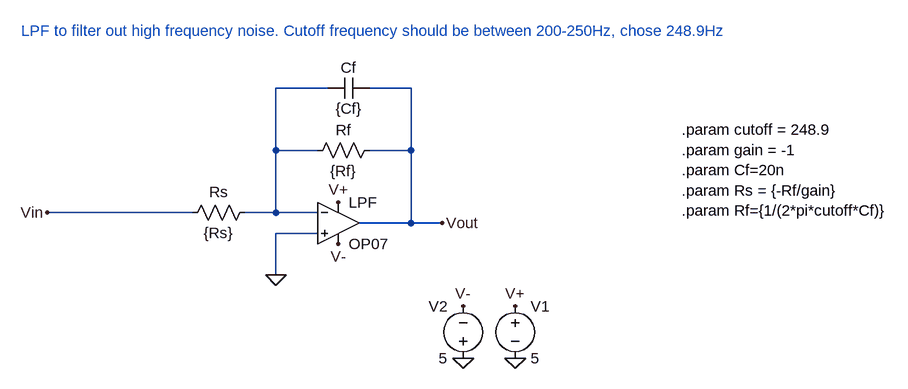
[diagram p0: schematic LPF.asc]
LPF.asc, the LTspice schematic file:
Version 4
SHEET 1 1440 680
WIRE 496 112 416 112
WIRE 624 112 560 112
WIRE 416 208 416 112
WIRE 480 208 416 208
WIRE 624 208 624 112
WIRE 624 208 560 208
WIRE 288 304 64 304
WIRE 416 304 416 208
WIRE 416 304 368 304
WIRE 480 304 416 304
WIRE 624 320 624 208
WIRE 624 320 544 320
WIRE 672 320 624 320
WIRE 480 336 416 336
WIRE 416 400 416 336
FLAG 704 528 0
FLAG 784 528 0
FLAG 416 400 0
FLAG 512 352 V-
FLAG 704 448 V-
FLAG 512 288 V+
FLAG 784 448 V+
FLAG 64 304 Vin
FLAG 672 320 Vout
SYMBOL voltage 784 432 R0
WINDOW 123 0 0 Left 0
WINDOW 39 0 0 Left 0
SYMATTR InstName V1
SYMATTR Value 5
SYMBOL voltage 704 544 R180
WINDOW 0 24 96 Left 2
WINDOW 3 24 16 Left 2
WINDOW 123 0 0 Left 0
WINDOW 39 0 0 Left 0
SYMATTR InstName V2
SYMATTR Value 5
SYMBOL OpAmps\\OP07 512 256 R0
SYMATTR InstName LPF
SYMBOL res 576 192 R90
WINDOW 0 0 56 VBottom 2
WINDOW 3 32 56 VTop 2
SYMATTR InstName Rf
SYMATTR Value {Rf}
SYMBOL res 384 288 R90
WINDOW 0 0 56 VBottom 2
WINDOW 3 32 56 VTop 2
SYMATTR InstName Rs
SYMATTR Value {Rs}
SYMBOL cap 560 96 R90
WINDOW 0 0 32 VBottom 2
WINDOW 3 32 32 VTop 2
SYMATTR InstName Cf
SYMATTR Value {Cf}
TEXT 24 24 Left 2 ;LPF to filter out high frequency noise. Cutoff frequency should be between 200-250Hz, chose 248.9Hz
TEXT 1040 176 Left 2 !.param cutoff = 248.9\n.param gain = -1\n.param Cf=20n\n.param Rs = {-Rf/gain}\n.param Rf={1/(2*pi*cutoff*Cf)}

The netlist it stands for:
* LPF.asc
V1 V+ 0 5
V2 0 V- 5
XLPF 0 N001 V+ V- Vout LT1001  ; OP07, pins In+ In- V+ V- OUT
Rf Vout N001 {Rf}
Rs N001 Vin {Rs}
Cf Vout N001 {Cf}
* LPF to filter out high frequency noise. Cutoff frequency should be between 200-250Hz, chose 248.9Hz
.param cutoff = 248.9
.param gain = -1
.param Cf=20n
.param Rs = {-Rf/gain}
.param Rf={1/(2*pi*cutoff*Cf)}
.lib LTC.lib
.backanno
.end